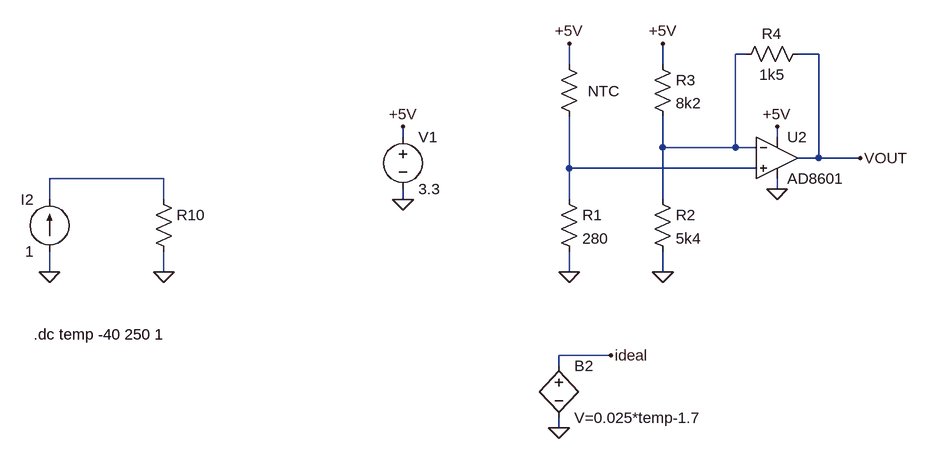
[diagram p0: schematic LTSpice.asc]
LTSpice.asc, the LTspice schematic file:
Version 4
SHEET 1 43944 804
WIRE 160 -32 144 -32
WIRE 272 -32 240 -32
WIRE -112 -16 -112 -48
WIRE 32 -16 32 -48
WIRE -368 96 -368 80
WIRE 208 96 208 80
WIRE 32 112 32 64
WIRE 144 112 144 -32
WIRE 144 112 32 112
WIRE 176 112 144 112
WIRE 272 128 272 -32
WIRE 272 128 240 128
WIRE 336 128 272 128
WIRE -112 144 -112 64
WIRE 176 144 -112 144
WIRE -736 160 -912 160
WIRE 208 176 208 160
WIRE -912 192 -912 160
WIRE -736 192 -736 160
WIRE -368 192 -368 176
WIRE -112 192 -112 144
WIRE 32 192 32 112
WIRE -912 304 -912 272
WIRE -736 304 -736 272
WIRE -112 304 -112 272
WIRE 32 304 32 272
WIRE -48 432 -128 432
WIRE -128 448 -128 432
WIRE -128 544 -128 528
FLAG -912 304 0
FLAG -736 304 0
FLAG -368 192 0
FLAG -112 304 0
FLAG 32 304 0
FLAG 208 176 0
FLAG 208 80 +5V
FLAG 336 128 VOUT
FLAG -48 432 ideal
FLAG -128 544 0
FLAG -368 80 +5V
FLAG -112 -48 +5V
FLAG 32 -48 +5V
SYMBOL res -752 176 R0
WINDOW 3 36 76 Invisible 2
SYMATTR Value R = table(temp,-40, 302.8k, -39, 288.388k, -38, 273.878k, -37, 259.472k, -36, 245.341k, -35, 231.621k, -34, 218.414k, -33, 205.792k, -32, 193.798k, -31, 182.455k, -30, 171.765k, -29, 161.719k, -28, 152.296k, -27, 143.472k, -26, 135.214k, -25, 127.49k, -24, 120.264k, -23, 113.504k, -22, 107.177k, -21, 101.252k, -20, 95.698k, -19, 90.488k, -18, 85.597k, -17, 81.002k, -16, 76.681k, -15, 72.615k, -14, 68.785k, -13, 65.176k, -12, 61.772k, -11, 58.561k, -10, 55.53k, -9, 52.667k, -8, 49.962k, -7, 47.406k, -6, 44.99k, -5, 42.705k, -4, 40.545k, -3, 38.501k, -2, 36.568k, -1, 34.74k, 0, 33.01k, 1, 31.372k, 2, 29.823k, 3, 28.357k, 4, 26.969k, 5, 25.655k, 6, 24.411k, 7, 23.234k, 8, 22.118k, 9, 21.063k, 10, 20.008k, 11, 19.115k, 12, 18.217k, 13, 17.366k, 14, 16.56k, 15, 15.795k, 16, 15.07k, 17, 14.383k, 18, 13.73k, 19, 13.111k, 20, 12.524k, 21, 11.966k, 22, 11.436k, 23, 10.932k, 24, 10.454k, 25, 10k, 26, 9.567k, 27, 9.156k, 28, 8.765k, 29, 8.393k, 30, 8.039k, 31, 7.702k, 32, 7.38k, 33, 7.074k, 34, 6.783k, 35, 6.505k, 36, 6.24k, 37, 5.987k, 38, 5.746k, 39, 5.516k, 40, 5.296k, 41, 5.087k, 42, 4.887k, 43, 4.695k, 44, 4.513k, 45, 4.338k, 46, 4.171k, 47, 4.012k, 48, 3.859k, 49, 3.713k, 50, 3.574k, 51, 3.44k, 52, 3.312k, 53, 3.19k, 54, 3.072k, 55, 2.96k, 56, 2.852k, 57, 2.749k, 58, 2.65k, 59, 2.556k, 60, 2.465k, 61, 2.378k, 62, 2.294k, 63, 2.214k, 64, 2.137k, 65, 2.063k, 66, 1.992k, 67, 1.924k, 68, 1.858k, 69, 1.795k, 70, 1.735k, 71, 1.677k, 72, 1.621k, 73, 1.567k, 74, 1.516k, 75, 1.466k, 76, 1.418k, 77, 1.372k, 78, 1.328k, 79, 1.285k, 80, 1.244k, 81, 1.205k, 82, 1.167k, 83, 1.13k, 84, 1.095k, 85, 1.061k, 86, 1.028k, 87, 0.996k, 88, 0.965k, 89, 0.936k, 90, 0.908k, 91, 0.88k, 92, 0.854k, 93, 0.828k, 94, 0.804k, 95, 0.78k, 96, 0.757k, 97, 0.735k, 98, 0.713k, 99, 0.692k, 100, 0.673k, 101, 0.653k, 102, 0.635k, 103, 0.616k, 104, 0.599k, 105, 0.582k, 106, 0.566k, 107, 0.55k, 108, 0.535k, 109, 0.52k, 110, 0.506k, 111, 0.492k, 112, 0.479k, 113, 0.466k, 114, 0.453k, 115, 0.441k, 116, 0.43k, 117, 0.418k, 118, 0.407k, 119, 0.397k, 120, 0.387k, 121, 0.377k, 122, 0.367k, 123, 0.358k, 124, 0.349k, 125, 0.34k, 126, 0.331k, 127, 0.323k, 128, 0.315k, 129, 0.308k, 130, 0.3k, 131, 0.293k, 132, 0.286k, 133, 0.279k, 134, 0.272k, 135, 0.266k, 136, 0.26k, 137, 0.254k, 138, 0.248k, 139, 0.242k, 140, 0.237k, 141, 0.231k, 142, 0.226k, 143, 0.221k, 144, 0.216k, 145, 0.211k, 146, 0.207k, 147, 0.202k, 148, 0.198k, 149, 0.193k, 150, 0.189k, 151, 0.185k, 152, 0.181k, 153, 0.177k, 154, 0.174k, 155, 0.17k, 156, 0.167k, 157, 0.163k, 158, 0.16k, 159, 0.156k, 160, 0.153k, 161, 0.15k, 162, 0.147k, 163, 0.144k, 164, 0.141k, 165, 0.138k, 166, 0.135k, 167, 0.133k, 168, 0.13k, 169, 0.127k, 170, 0.125k, 171, 0.122k, 172, 0.12k, 173, 0.118k, 174, 0.115k, 175, 0.113k, 176, 0.111k, 177, 0.108k, 178, 0.106k, 179, 0.104k, 180, 0.102k, 181, 0.1k, 182, 0.098k, 183, 0.096k, 184, 0.094k, 185, 0.092k, 186, 0.09k, 187, 0.088k, 188, 0.087k, 189, 0.085k, 190, 0.083k, 191, 0.081k, 192, 0.08k, 193, 0.078k, 194, 0.076k, 195, 0.075k, 196, 0.073k, 197, 0.072k, 198, 0.07k, 199, 0.069k, 200, 0.067k, 201, 0.066k, 202, 0.064k, 203, 0.063k, 204, 0.062k, 205, 0.06k, 206, 0.059k, 207, 0.058k, 208, 0.057k, 209, 0.055k, 210, 0.054k, 211, 0.053k, 212, 0.052k, 213, 0.051k, 214, 0.05k, 215, 0.049k, 216, 0.048k, 217, 0.047k, 218, 0.046k, 219, 0.045k, 220, 0.044k, 221, 0.043k, 222, 0.042k, 223, 0.041k, 224, 0.04k, 225, 0.039k, 226, 0.039k, 227, 0.038k, 228, 0.037k, 229, 0.037k, 230, 0.036k, 231, 0.035k, 232, 0.035k, 233, 0.034k, 234, 0.034k, 235, 0.033k, 236, 0.033k, 237, 0.032k, 238, 0.032k, 239, 0.031k, 240, 0.031k, 241, 0.031k, 242, 0.03k, 243, 0.03k, 244, 0.03k, 245, 0.03k, 246, 0.029k, 247, 0.029k, 248, 0.029k, 249, 0.029k, 250, 0.029k)
SYMATTR InstName R10
SYMBOL current -912 272 R180
WINDOW 0 24 80 Left 2
WINDOW 3 24 0 Left 2
WINDOW 123 0 0 Left 0
WINDOW 39 0 0 Left 0
SYMATTR InstName I2
SYMATTR Value 1
SYMBOL res -128 -32 R0
WINDOW 3 36 76 Invisible 2
WINDOW 0 45 57 Left 2
SYMATTR Value R = table(temp,-40, 302.8k, -39, 288.388k, -38, 273.878k, -37, 259.472k, -36, 245.341k, -35, 231.621k, -34, 218.414k, -33, 205.792k, -32, 193.798k, -31, 182.455k, -30, 171.765k, -29, 161.719k, -28, 152.296k, -27, 143.472k, -26, 135.214k, -25, 127.49k, -24, 120.264k, -23, 113.504k, -22, 107.177k, -21, 101.252k, -20, 95.698k, -19, 90.488k, -18, 85.597k, -17, 81.002k, -16, 76.681k, -15, 72.615k, -14, 68.785k, -13, 65.176k, -12, 61.772k, -11, 58.561k, -10, 55.53k, -9, 52.667k, -8, 49.962k, -7, 47.406k, -6, 44.99k, -5, 42.705k, -4, 40.545k, -3, 38.501k, -2, 36.568k, -1, 34.74k, 0, 33.01k, 1, 31.372k, 2, 29.823k, 3, 28.357k, 4, 26.969k, 5, 25.655k, 6, 24.411k, 7, 23.234k, 8, 22.118k, 9, 21.063k, 10, 20.008k, 11, 19.115k, 12, 18.217k, 13, 17.366k, 14, 16.56k, 15, 15.795k, 16, 15.07k, 17, 14.383k, 18, 13.73k, 19, 13.111k, 20, 12.524k, 21, 11.966k, 22, 11.436k, 23, 10.932k, 24, 10.454k, 25, 10k, 26, 9.567k, 27, 9.156k, 28, 8.765k, 29, 8.393k, 30, 8.039k, 31, 7.702k, 32, 7.38k, 33, 7.074k, 34, 6.783k, 35, 6.505k, 36, 6.24k, 37, 5.987k, 38, 5.746k, 39, 5.516k, 40, 5.296k, 41, 5.087k, 42, 4.887k, 43, 4.695k, 44, 4.513k, 45, 4.338k, 46, 4.171k, 47, 4.012k, 48, 3.859k, 49, 3.713k, 50, 3.574k, 51, 3.44k, 52, 3.312k, 53, 3.19k, 54, 3.072k, 55, 2.96k, 56, 2.852k, 57, 2.749k, 58, 2.65k, 59, 2.556k, 60, 2.465k, 61, 2.378k, 62, 2.294k, 63, 2.214k, 64, 2.137k, 65, 2.063k, 66, 1.992k, 67, 1.924k, 68, 1.858k, 69, 1.795k, 70, 1.735k, 71, 1.677k, 72, 1.621k, 73, 1.567k, 74, 1.516k, 75, 1.466k, 76, 1.418k, 77, 1.372k, 78, 1.328k, 79, 1.285k, 80, 1.244k, 81, 1.205k, 82, 1.167k, 83, 1.13k, 84, 1.095k, 85, 1.061k, 86, 1.028k, 87, 0.996k, 88, 0.965k, 89, 0.936k, 90, 0.908k, 91, 0.88k, 92, 0.854k, 93, 0.828k, 94, 0.804k, 95, 0.78k, 96, 0.757k, 97, 0.735k, 98, 0.713k, 99, 0.692k, 100, 0.673k, 101, 0.653k, 102, 0.635k, 103, 0.616k, 104, 0.599k, 105, 0.582k, 106, 0.566k, 107, 0.55k, 108, 0.535k, 109, 0.52k, 110, 0.506k, 111, 0.492k, 112, 0.479k, 113, 0.466k, 114, 0.453k, 115, 0.441k, 116, 0.43k, 117, 0.418k, 118, 0.407k, 119, 0.397k, 120, 0.387k, 121, 0.377k, 122, 0.367k, 123, 0.358k, 124, 0.349k, 125, 0.34k, 126, 0.331k, 127, 0.323k, 128, 0.315k, 129, 0.308k, 130, 0.3k, 131, 0.293k, 132, 0.286k, 133, 0.279k, 134, 0.272k, 135, 0.266k, 136, 0.26k, 137, 0.254k, 138, 0.248k, 139, 0.242k, 140, 0.237k, 141, 0.231k, 142, 0.226k, 143, 0.221k, 144, 0.216k, 145, 0.211k, 146, 0.207k, 147, 0.202k, 148, 0.198k, 149, 0.193k, 150, 0.189k, 151, 0.185k, 152, 0.181k, 153, 0.177k, 154, 0.174k, 155, 0.17k, 156, 0.167k, 157, 0.163k, 158, 0.16k, 159, 0.156k, 160, 0.153k, 161, 0.15k, 162, 0.147k, 163, 0.144k, 164, 0.141k, 165, 0.138k, 166, 0.135k, 167, 0.133k, 168, 0.13k, 169, 0.127k, 170, 0.125k, 171, 0.122k, 172, 0.12k, 173, 0.118k, 174, 0.115k, 175, 0.113k, 176, 0.111k, 177, 0.108k, 178, 0.106k, 179, 0.104k, 180, 0.102k, 181, 0.1k, 182, 0.098k, 183, 0.096k, 184, 0.094k, 185, 0.092k, 186, 0.09k, 187, 0.088k, 188, 0.087k, 189, 0.085k, 190, 0.083k, 191, 0.081k, 192, 0.08k, 193, 0.078k, 194, 0.076k, 195, 0.075k, 196, 0.073k, 197, 0.072k, 198, 0.07k, 199, 0.069k, 200, 0.067k, 201, 0.066k, 202, 0.064k, 203, 0.063k, 204, 0.062k, 205, 0.06k, 206, 0.059k, 207, 0.058k, 208, 0.057k, 209, 0.055k, 210, 0.054k, 211, 0.053k, 212, 0.052k, 213, 0.051k, 214, 0.05k, 215, 0.049k, 216, 0.048k, 217, 0.047k, 218, 0.046k, 219, 0.045k, 220, 0.044k, 221, 0.043k, 222, 0.042k, 223, 0.041k, 224, 0.04k, 225, 0.039k, 226, 0.039k, 227, 0.038k, 228, 0.037k, 229, 0.037k, 230, 0.036k, 231, 0.035k, 232, 0.035k, 233, 0.034k, 234, 0.034k, 235, 0.033k, 236, 0.033k, 237, 0.032k, 238, 0.032k, 239, 0.031k, 240, 0.031k, 241, 0.031k, 242, 0.03k, 243, 0.03k, 244, 0.03k, 245, 0.03k, 246, 0.029k, 247, 0.029k, 248, 0.029k, 249, 0.029k, 250, 0.029k)
SYMATTR InstName NTC
SYMBOL res -128 176 R0
SYMATTR InstName R1
SYMATTR Value 280
SYMBOL res 16 176 R0
SYMATTR InstName R2
SYMATTR Value 5k4
SYMBOL res 16 -32 R0
SYMATTR InstName R3
SYMATTR Value 8k2
SYMBOL voltage -368 80 R0
WINDOW 123 0 0 Left 0
WINDOW 39 0 0 Left 0
SYMATTR InstName V1
SYMATTR Value 3.3
SYMBOL res 256 -48 R90
WINDOW 0 0 56 VBottom 2
WINDOW 3 32 56 VTop 2
SYMATTR InstName R4
SYMATTR Value 1k5
SYMBOL bv -128 432 R0
SYMATTR InstName B2
SYMATTR Value V=0.025*temp-1.7
SYMBOL OpAmps\\AD8601 208 64 R0
SYMATTR InstName U2
TEXT -936 400 Left 2 !.dc temp -40 250 1

The netlist it stands for:
* LTSpice.asc
R10 N003 0 R = table(temp,-40, 302.8k, -39, 288.388k, -38, 273.878k, -37, 259.472k, -36, 245.341k, -35, 231.621k, -34, 218.414k, -33, 205.792k, -32, 193.798k, -31, 182.455k, -30, 171.765k, -29, 161.719k, -28, 152.296k, -27, 143.472k, -26, 135.214k, -25, 127.49k, -24, 120.264k, -23, 113.504k, -22, 107.177k, -21, 101.252k, -20, 95.698k, -19, 90.488k, -18, 85.597k, -17, 81.002k, -16, 76.681k, -15, 72.615k, -14, 68.785k, -13, 65.176k, -12, 61.772k, -11, 58.561k, -10, 55.53k, -9, 52.667k, -8, 49.962k, -7, 47.406k, -6, 44.99k, -5, 42.705k, -4, 40.545k, -3, 38.501k, -2, 36.568k, -1, 34.74k, 0, 33.01k, 1, 31.372k, 2, 29.823k, 3, 28.357k, 4, 26.969k, 5, 25.655k, 6, 24.411k, 7, 23.234k, 8, 22.118k, 9, 21.063k, 10, 20.008k, 11, 19.115k, 12, 18.217k, 13, 17.366k, 14, 16.56k, 15, 15.795k, 16, 15.07k, 17, 14.383k, 18, 13.73k, 19, 13.111k, 20, 12.524k, 21, 11.966k, 22, 11.436k, 23, 10.932k, 24, 10.454k, 25, 10k, 26, 9.567k, 27, 9.156k, 28, 8.765k, 29, 8.393k, 30, 8.039k, 31, 7.702k, 32, 7.38k, 33, 7.074k, 34, 6.783k, 35, 6.505k, 36, 6.24k, 37, 5.987k, 38, 5.746k, 39, 5.516k, 40, 5.296k, 41, 5.087k, 42, 4.887k, 43, 4.695k, 44, 4.513k, 45, 4.338k, 46, 4.171k, 47, 4.012k, 48, 3.859k, 49, 3.713k, 50, 3.574k, 51, 3.44k, 52, 3.312k, 53, 3.19k, 54, 3.072k, 55, 2.96k, 56, 2.852k, 57, 2.749k, 58, 2.65k, 59, 2.556k, 60, 2.465k, 61, 2.378k, 62, 2.294k, 63, 2.214k, 64, 2.137k, 65, 2.063k, 66, 1.992k, 67, 1.924k, 68, 1.858k, 69, 1.795k, 70, 1.735k, 71, 1.677k, 72, 1.621k, 73, 1.567k, 74, 1.516k, 75, 1.466k, 76, 1.418k, 77, 1.372k, 78, 1.328k, 79, 1.285k, 80, 1.244k, 81, 1.205k, 82, 1.167k, 83, 1.13k, 84, 1.095k, 85, 1.061k, 86, 1.028k, 87, 0.996k, 88, 0.965k, 89, 0.936k, 90, 0.908k, 91, 0.88k, 92, 0.854k, 93, 0.828k, 94, 0.804k, 95, 0.78k, 96, 0.757k, 97, 0.735k, 98, 0.713k, 99, 0.692k, 100, 0.673k, 101, 0.653k, 102, 0.635k, 103, 0.616k, 104, 0.599k, 105, 0.582k, 106, 0.566k, 107, 0.55k, 108, 0.535k, 109, 0.52k, 110, 0.506k, 111, 0.492k, 112, 0.479k, 113, 0.466k, 114, 0.453k, 115, 0.441k, 116, 0.43k, 117, 0.418k, 118, 0.407k, 119, 0.397k, 120, 0.387k, 121, 0.377k, 122, 0.367k, 123, 0.358k, 124, 0.349k, 125, 0.34k, 126, 0.331k, 127, 0.323k, 128, 0.315k, 129, 0.308k, 130, 0.3k, 131, 0.293k, 132, 0.286k, 133, 0.279k, 134, 0.272k, 135, 0.266k, 136, 0.26k, 137, 0.254k, 138, 0.248k, 139, 0.242k, 140, 0.237k, 141, 0.231k, 142, 0.226k, 143, 0.221k, 144, 0.216k, 145, 0.211k, 146, 0.207k, 147, 0.202k, 148, 0.198k, 149, 0.193k, 150, 0.189k, 151, 0.185k, 152, 0.181k, 153, 0.177k, 154, 0.174k, 155, 0.17k, 156, 0.167k, 157, 0.163k, 158, 0.16k, 159, 0.156k, 160, 0.153k, 161, 0.15k, 162, 0.147k, 163, 0.144k, 164, 0.141k, 165, 0.138k, 166, 0.135k, 167, 0.133k, 168, 0.13k, 169, 0.127k, 170, 0.125k, 171, 0.122k, 172, 0.12k, 173, 0.118k, 174, 0.115k, 175, 0.113k, 176, 0.111k, 177, 0.108k, 178, 0.106k, 179, 0.104k, 180, 0.102k, 181, 0.1k, 182, 0.098k, 183, 0.096k, 184, 0.094k, 185, 0.092k, 186, 0.09k, 187, 0.088k, 188, 0.087k, 189, 0.085k, 190, 0.083k, 191, 0.081k, 192, 0.08k, 193, 0.078k, 194, 0.076k, 195, 0.075k, 196, 0.073k, 197, 0.072k, 198, 0.07k, 199, 0.069k, 200, 0.067k, 201, 0.066k, 202, 0.064k, 203, 0.063k, 204, 0.062k, 205, 0.06k, 206, 0.059k, 207, 0.058k, 208, 0.057k, 209, 0.055k, 210, 0.054k, 211, 0.053k, 212, 0.052k, 213, 0.051k, 214, 0.05k, 215, 0.049k, 216, 0.048k, 217, 0.047k, 218, 0.046k, 219, 0.045k, 220, 0.044k, 221, 0.043k, 222, 0.042k, 223, 0.041k, 224, 0.04k, 225, 0.039k, 226, 0.039k, 227, 0.038k, 228, 0.037k, 229, 0.037k, 230, 0.036k, 231, 0.035k, 232, 0.035k, 233, 0.034k, 234, 0.034k, 235, 0.033k, 236, 0.033k, 237, 0.032k, 238, 0.032k, 239, 0.031k, 240, 0.031k, 241, 0.031k, 242, 0.03k, 243, 0.03k, 244, 0.03k, 245, 0.03k, 246, 0.029k, 247, 0.029k, 248, 0.029k, 249, 0.029k, 250, 0.029k)
I2 0 N003 1
R§NTC +5V N002 R = table(temp,-40, 302.8k, -39, 288.388k, -38, 273.878k, -37, 259.472k, -36, 245.341k, -35, 231.621k, -34, 218.414k, -33, 205.792k, -32, 193.798k, -31, 182.455k, -30, 171.765k, -29, 161.719k, -28, 152.296k, -27, 143.472k, -26, 135.214k, -25, 127.49k, -24, 120.264k, -23, 113.504k, -22, 107.177k, -21, 101.252k, -20, 95.698k, -19, 90.488k, -18, 85.597k, -17, 81.002k, -16, 76.681k, -15, 72.615k, -14, 68.785k, -13, 65.176k, -12, 61.772k, -11, 58.561k, -10, 55.53k, -9, 52.667k, -8, 49.962k, -7, 47.406k, -6, 44.99k, -5, 42.705k, -4, 40.545k, -3, 38.501k, -2, 36.568k, -1, 34.74k, 0, 33.01k, 1, 31.372k, 2, 29.823k, 3, 28.357k, 4, 26.969k, 5, 25.655k, 6, 24.411k, 7, 23.234k, 8, 22.118k, 9, 21.063k, 10, 20.008k, 11, 19.115k, 12, 18.217k, 13, 17.366k, 14, 16.56k, 15, 15.795k, 16, 15.07k, 17, 14.383k, 18, 13.73k, 19, 13.111k, 20, 12.524k, 21, 11.966k, 22, 11.436k, 23, 10.932k, 24, 10.454k, 25, 10k, 26, 9.567k, 27, 9.156k, 28, 8.765k, 29, 8.393k, 30, 8.039k, 31, 7.702k, 32, 7.38k, 33, 7.074k, 34, 6.783k, 35, 6.505k, 36, 6.24k, 37, 5.987k, 38, 5.746k, 39, 5.516k, 40, 5.296k, 41, 5.087k, 42, 4.887k, 43, 4.695k, 44, 4.513k, 45, 4.338k, 46, 4.171k, 47, 4.012k, 48, 3.859k, 49, 3.713k, 50, 3.574k, 51, 3.44k, 52, 3.312k, 53, 3.19k, 54, 3.072k, 55, 2.96k, 56, 2.852k, 57, 2.749k, 58, 2.65k, 59, 2.556k, 60, 2.465k, 61, 2.378k, 62, 2.294k, 63, 2.214k, 64, 2.137k, 65, 2.063k, 66, 1.992k, 67, 1.924k, 68, 1.858k, 69, 1.795k, 70, 1.735k, 71, 1.677k, 72, 1.621k, 73, 1.567k, 74, 1.516k, 75, 1.466k, 76, 1.418k, 77, 1.372k, 78, 1.328k, 79, 1.285k, 80, 1.244k, 81, 1.205k, 82, 1.167k, 83, 1.13k, 84, 1.095k, 85, 1.061k, 86, 1.028k, 87, 0.996k, 88, 0.965k, 89, 0.936k, 90, 0.908k, 91, 0.88k, 92, 0.854k, 93, 0.828k, 94, 0.804k, 95, 0.78k, 96, 0.757k, 97, 0.735k, 98, 0.713k, 99, 0.692k, 100, 0.673k, 101, 0.653k, 102, 0.635k, 103, 0.616k, 104, 0.599k, 105, 0.582k, 106, 0.566k, 107, 0.55k, 108, 0.535k, 109, 0.52k, 110, 0.506k, 111, 0.492k, 112, 0.479k, 113, 0.466k, 114, 0.453k, 115, 0.441k, 116, 0.43k, 117, 0.418k, 118, 0.407k, 119, 0.397k, 120, 0.387k, 121, 0.377k, 122, 0.367k, 123, 0.358k, 124, 0.349k, 125, 0.34k, 126, 0.331k, 127, 0.323k, 128, 0.315k, 129, 0.308k, 130, 0.3k, 131, 0.293k, 132, 0.286k, 133, 0.279k, 134, 0.272k, 135, 0.266k, 136, 0.26k, 137, 0.254k, 138, 0.248k, 139, 0.242k, 140, 0.237k, 141, 0.231k, 142, 0.226k, 143, 0.221k, 144, 0.216k, 145, 0.211k, 146, 0.207k, 147, 0.202k, 148, 0.198k, 149, 0.193k, 150, 0.189k, 151, 0.185k, 152, 0.181k, 153, 0.177k, 154, 0.174k, 155, 0.17k, 156, 0.167k, 157, 0.163k, 158, 0.16k, 159, 0.156k, 160, 0.153k, 161, 0.15k, 162, 0.147k, 163, 0.144k, 164, 0.141k, 165, 0.138k, 166, 0.135k, 167, 0.133k, 168, 0.13k, 169, 0.127k, 170, 0.125k, 171, 0.122k, 172, 0.12k, 173, 0.118k, 174, 0.115k, 175, 0.113k, 176, 0.111k, 177, 0.108k, 178, 0.106k, 179, 0.104k, 180, 0.102k, 181, 0.1k, 182, 0.098k, 183, 0.096k, 184, 0.094k, 185, 0.092k, 186, 0.09k, 187, 0.088k, 188, 0.087k, 189, 0.085k, 190, 0.083k, 191, 0.081k, 192, 0.08k, 193, 0.078k, 194, 0.076k, 195, 0.075k, 196, 0.073k, 197, 0.072k, 198, 0.07k, 199, 0.069k, 200, 0.067k, 201, 0.066k, 202, 0.064k, 203, 0.063k, 204, 0.062k, 205, 0.06k, 206, 0.059k, 207, 0.058k, 208, 0.057k, 209, 0.055k, 210, 0.054k, 211, 0.053k, 212, 0.052k, 213, 0.051k, 214, 0.05k, 215, 0.049k, 216, 0.048k, 217, 0.047k, 218, 0.046k, 219, 0.045k, 220, 0.044k, 221, 0.043k, 222, 0.042k, 223, 0.041k, 224, 0.04k, 225, 0.039k, 226, 0.039k, 227, 0.038k, 228, 0.037k, 229, 0.037k, 230, 0.036k, 231, 0.035k, 232, 0.035k, 233, 0.034k, 234, 0.034k, 235, 0.033k, 236, 0.033k, 237, 0.032k, 238, 0.032k, 239, 0.031k, 240, 0.031k, 241, 0.031k, 242, 0.03k, 243, 0.03k, 244, 0.03k, 245, 0.03k, 246, 0.029k, 247, 0.029k, 248, 0.029k, 249, 0.029k, 250, 0.029k)
R1 N002 0 280
R2 N001 0 5k4
R3 +5V N001 8k2
V1 +5V 0 3.3
R4 VOUT N001 1k5
B2 ideal 0 V=0.025*temp-1.7
XU2 N002 N001 +5V 0 VOUT AD8601  ; pins In+ In- V+ V- OUT
.dc temp -40 250 1
.backanno
.end